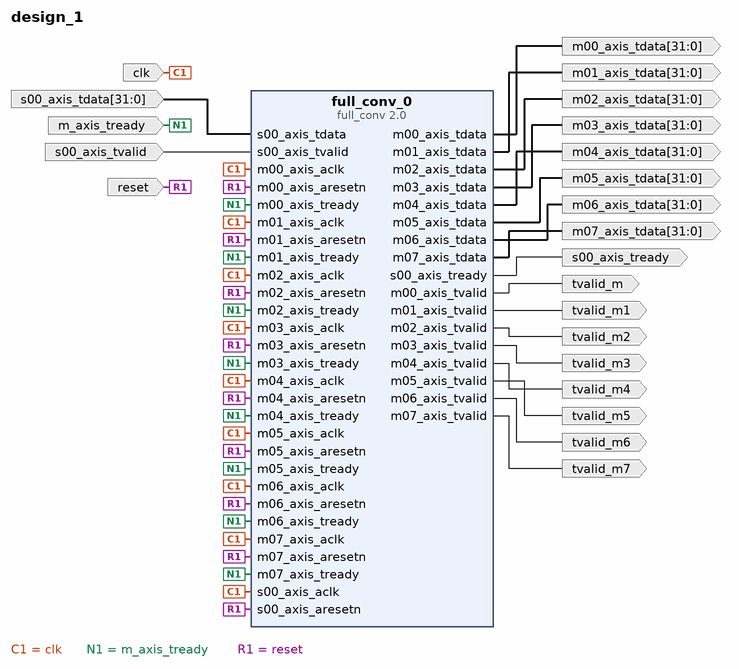
[diagram p0: block diagram of the top level]
# Vivado block design design_1, xc7z020clg400-1, Vivado 2024.1
create_bd_design design_1

create_bd_port -dir I -type clk clk
set_property -dict {CONFIG.FREQ_HZ 150000000} [get_bd_ports clk]
create_bd_port -dir I -type rst reset
create_bd_port -dir I -from 31 -to 0 -type data s00_axis_tdata
create_bd_port -dir O s00_axis_tready
create_bd_port -dir O -from 31 -to 0 -type data m00_axis_tdata
create_bd_port -dir O -from 31 -to 0 -type data m01_axis_tdata
create_bd_port -dir O -from 31 -to 0 -type data m02_axis_tdata
create_bd_port -dir O -from 31 -to 0 -type data m03_axis_tdata
create_bd_port -dir O -from 31 -to 0 -type data m04_axis_tdata
create_bd_port -dir O -from 31 -to 0 -type data m05_axis_tdata
create_bd_port -dir O -from 31 -to 0 -type data m06_axis_tdata
create_bd_port -dir O -from 31 -to 0 -type data m07_axis_tdata
create_bd_port -dir O tvalid_m
create_bd_port -dir I m_axis_tready
create_bd_port -dir O tvalid_m1
create_bd_port -dir O tvalid_m2
create_bd_port -dir O tvalid_m3
create_bd_port -dir O tvalid_m4
create_bd_port -dir O tvalid_m5
create_bd_port -dir O tvalid_m6
create_bd_port -dir O tvalid_m7
create_bd_port -dir I s00_axis_tvalid

create_bd_cell -type ip -vlnv user.org:user:full_conv:2.0 full_conv_0

# ---- connections ----

connect_bd_net [get_bd_ports clk] \
  [get_bd_pins full_conv_0/s00_axis_aclk] [get_bd_pins full_conv_0/m00_axis_aclk] [get_bd_pins full_conv_0/m01_axis_aclk] \
  [get_bd_pins full_conv_0/m02_axis_aclk] [get_bd_pins full_conv_0/m03_axis_aclk] [get_bd_pins full_conv_0/m04_axis_aclk] \
  [get_bd_pins full_conv_0/m05_axis_aclk] [get_bd_pins full_conv_0/m06_axis_aclk] [get_bd_pins full_conv_0/m07_axis_aclk]
connect_bd_net [get_bd_pins full_conv_0/m00_axis_tdata] [get_bd_ports m00_axis_tdata]
connect_bd_net [get_bd_pins full_conv_0/m00_axis_tvalid] [get_bd_ports tvalid_m]
connect_bd_net [get_bd_pins full_conv_0/m01_axis_tdata] [get_bd_ports m01_axis_tdata]
connect_bd_net [get_bd_pins full_conv_0/m01_axis_tvalid] [get_bd_ports tvalid_m1]
connect_bd_net [get_bd_pins full_conv_0/m02_axis_tdata] [get_bd_ports m02_axis_tdata]
connect_bd_net [get_bd_pins full_conv_0/m02_axis_tvalid] [get_bd_ports tvalid_m2]
connect_bd_net [get_bd_pins full_conv_0/m03_axis_tdata] [get_bd_ports m03_axis_tdata]
connect_bd_net [get_bd_pins full_conv_0/m03_axis_tvalid] [get_bd_ports tvalid_m3]
connect_bd_net [get_bd_pins full_conv_0/m04_axis_tdata] [get_bd_ports m04_axis_tdata]
connect_bd_net [get_bd_pins full_conv_0/m04_axis_tvalid] [get_bd_ports tvalid_m4]
connect_bd_net [get_bd_pins full_conv_0/m05_axis_tdata] [get_bd_ports m05_axis_tdata]
connect_bd_net [get_bd_pins full_conv_0/m05_axis_tvalid] [get_bd_ports tvalid_m5]
connect_bd_net [get_bd_pins full_conv_0/m06_axis_tdata] [get_bd_ports m06_axis_tdata]
connect_bd_net [get_bd_pins full_conv_0/m06_axis_tvalid] [get_bd_ports tvalid_m6]
connect_bd_net [get_bd_pins full_conv_0/m07_axis_tdata] [get_bd_ports m07_axis_tdata]
connect_bd_net [get_bd_pins full_conv_0/m07_axis_tvalid] [get_bd_ports tvalid_m7]
connect_bd_net [get_bd_pins full_conv_0/s00_axis_tready] [get_bd_ports s00_axis_tready]
connect_bd_net [get_bd_ports m_axis_tready] \
  [get_bd_pins full_conv_0/m00_axis_tready] [get_bd_pins full_conv_0/m01_axis_tready] \
  [get_bd_pins full_conv_0/m02_axis_tready] [get_bd_pins full_conv_0/m03_axis_tready] \
  [get_bd_pins full_conv_0/m04_axis_tready] [get_bd_pins full_conv_0/m05_axis_tready] \
  [get_bd_pins full_conv_0/m06_axis_tready] [get_bd_pins full_conv_0/m07_axis_tready]
connect_bd_net [get_bd_ports reset] \
  [get_bd_pins full_conv_0/s00_axis_aresetn] [get_bd_pins full_conv_0/m00_axis_aresetn] \
  [get_bd_pins full_conv_0/m01_axis_aresetn] [get_bd_pins full_conv_0/m02_axis_aresetn] \
  [get_bd_pins full_conv_0/m03_axis_aresetn] [get_bd_pins full_conv_0/m04_axis_aresetn] \
  [get_bd_pins full_conv_0/m05_axis_aresetn] [get_bd_pins full_conv_0/m06_axis_aresetn] \
  [get_bd_pins full_conv_0/m07_axis_aresetn]
connect_bd_net [get_bd_ports s00_axis_tdata] [get_bd_pins full_conv_0/s00_axis_tdata]
connect_bd_net [get_bd_ports s00_axis_tvalid] [get_bd_pins full_conv_0/s00_axis_tvalid]

validate_bd_design
save_bd_design
